# Altium schematic sheet Amplifier.SchDoc: Amplifier
size C; Engineer: Benjamin Beaudoin; Revision: v0.1
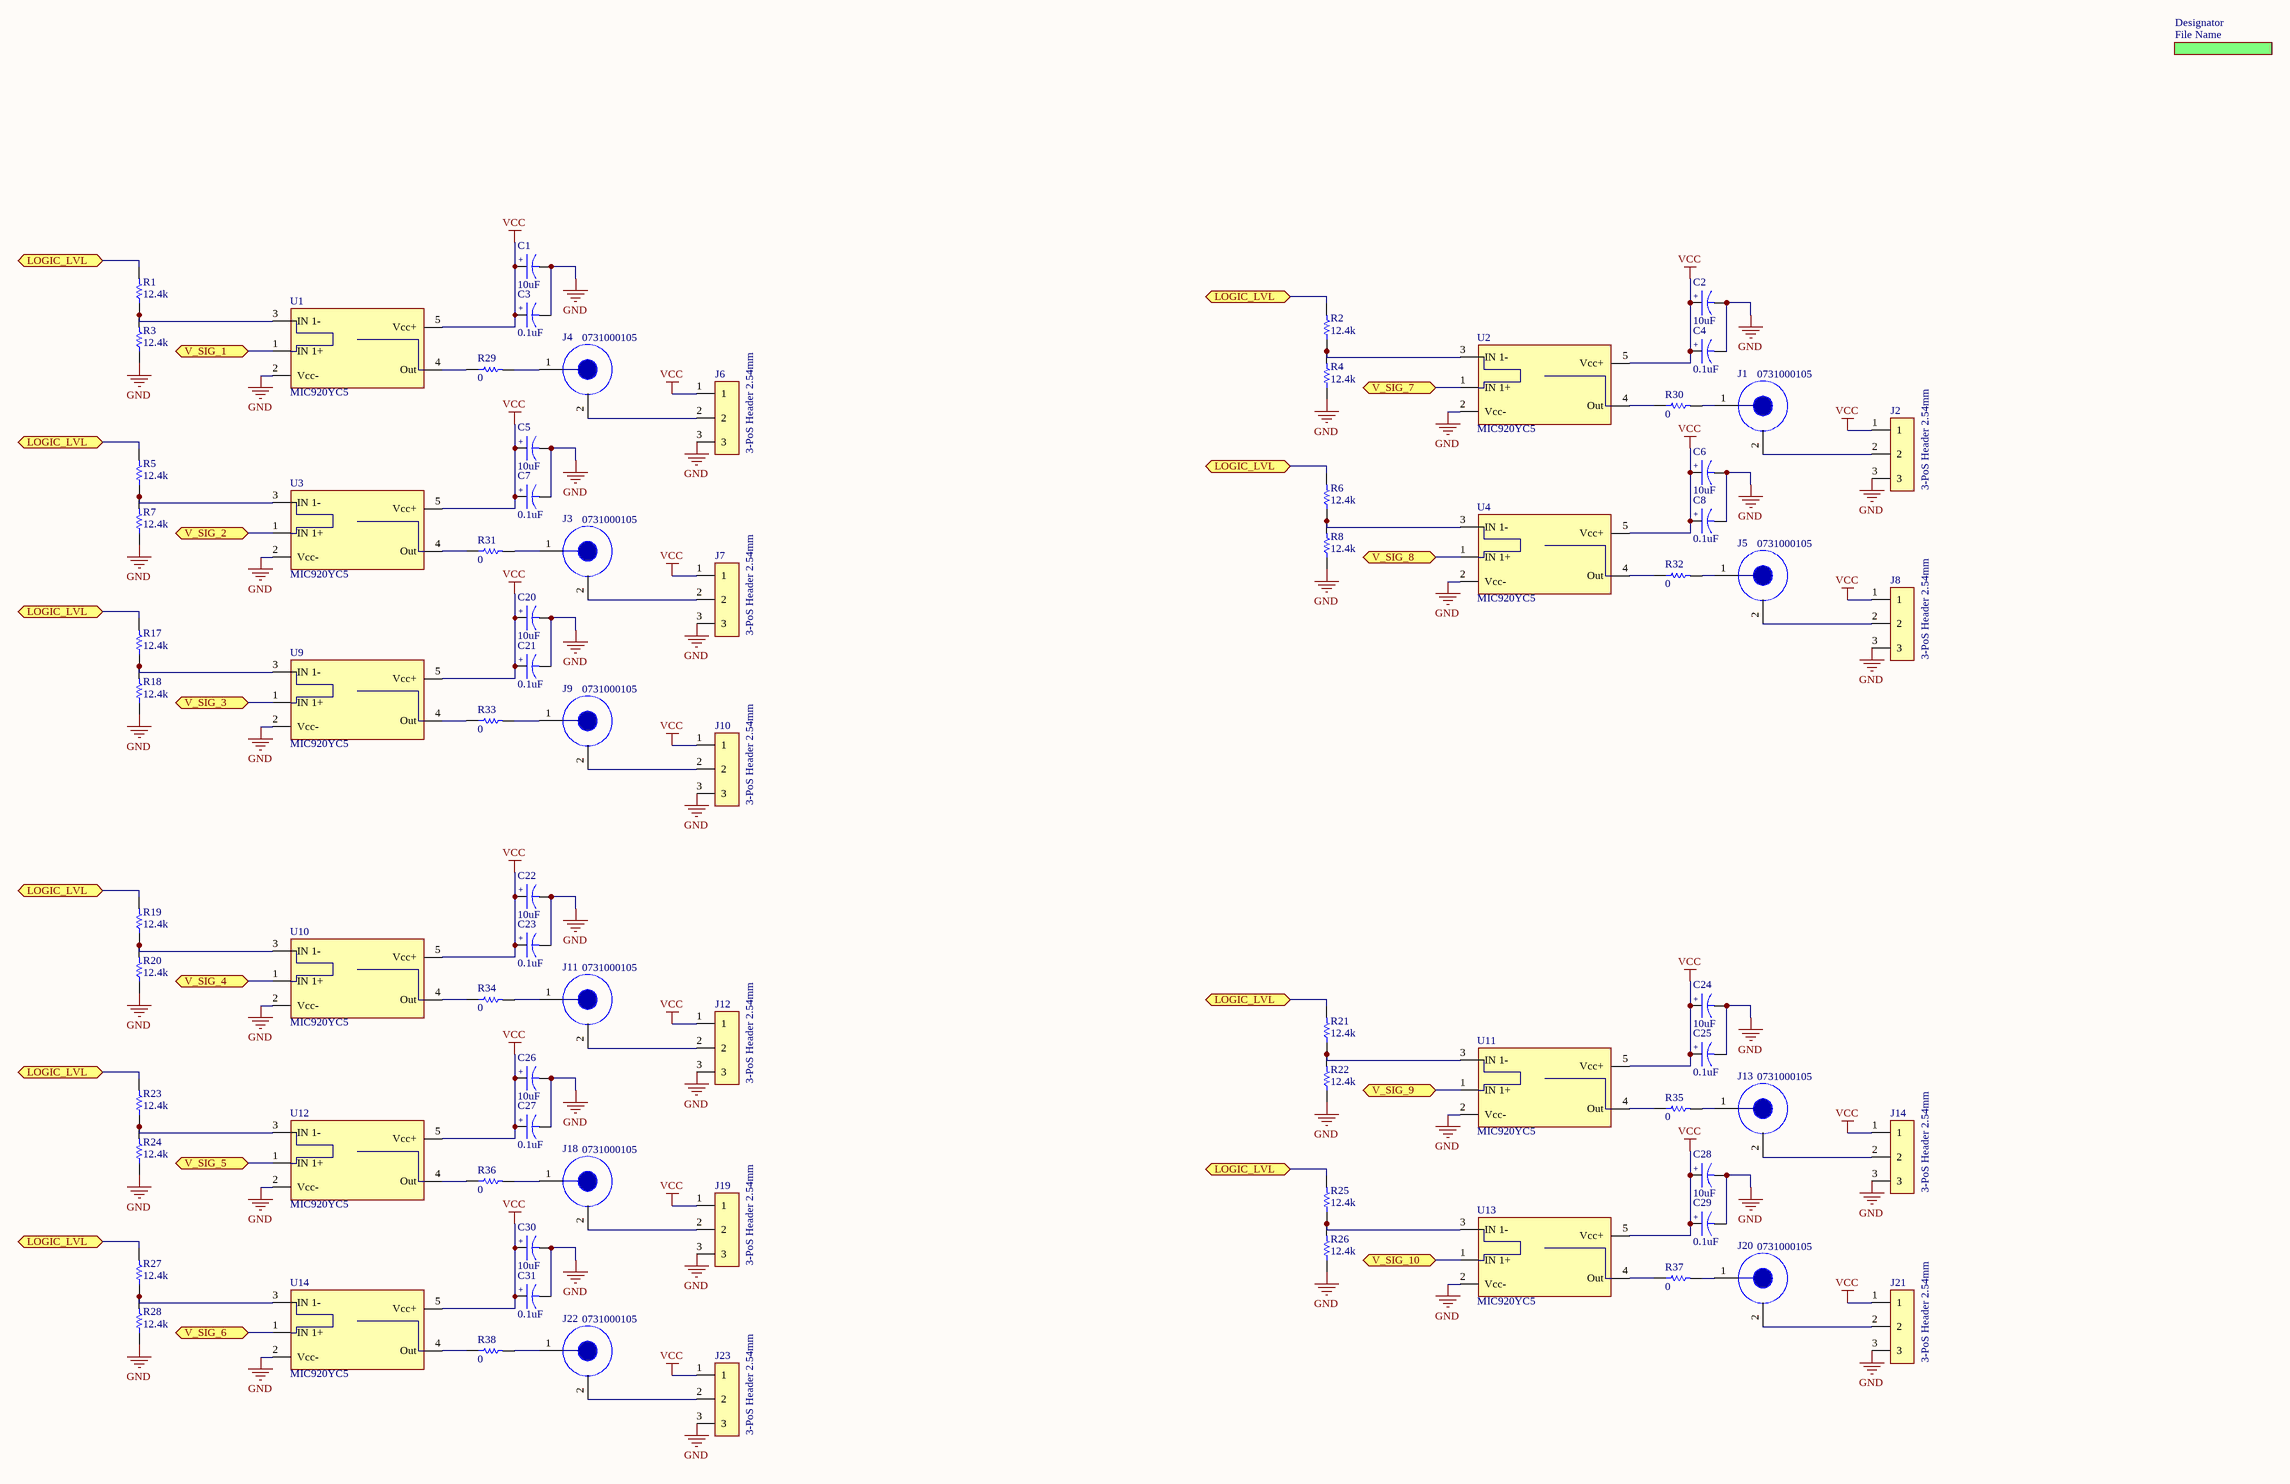
[diagram p0: Amplifier.SchDoc]

## Parts
C1  10uF  [0603C]
C2  10uF  [0603C]
C3  0.1uF  [0603C]
C4  0.1uF  [0603C]
C5  10uF  [0603C]
C6  10uF  [0603C]
C7  0.1uF  [0603C]
C8  0.1uF  [0603C]
C20  10uF  [0603C]
C21  0.1uF  [0603C]
C22  10uF  [0603C]
C23  0.1uF  [0603C]
C24  10uF  [0603C]
C25  0.1uF  [0603C]
C26  10uF  [0603C]
C27  0.1uF  [0603C]
C28  10uF  [0603C]
C29  0.1uF  [0603C]
C30  10uF  [0603C]
C31  0.1uF  [0603C]
J1  0731000105  [0731000105]
J2  3-PoS Header 2.54mm  [3-POS 2.54mm Pitch Header - duplicate]
J3  0731000105  [0731000105]
J4  0731000105  [0731000105]
J5  0731000105  [0731000105]
J6  3-PoS Header 2.54mm  [3-POS 2.54mm Pitch Header - duplicate]
J7  3-PoS Header 2.54mm  [3-POS 2.54mm Pitch Header - duplicate]
J8  3-PoS Header 2.54mm  [3-POS 2.54mm Pitch Header - duplicate]
J9  0731000105  [0731000105]
J10  3-PoS Header 2.54mm  [3-POS 2.54mm Pitch Header - duplicate]
J11  0731000105  [0731000105]
J12  3-PoS Header 2.54mm  [3-POS 2.54mm Pitch Header - duplicate]
J13  0731000105  [0731000105]
J14  3-PoS Header 2.54mm  [3-POS 2.54mm Pitch Header - duplicate]
J18  0731000105  [0731000105]
J19  3-PoS Header 2.54mm  [3-POS 2.54mm Pitch Header - duplicate]
J20  0731000105  [0731000105]
J21  3-PoS Header 2.54mm  [3-POS 2.54mm Pitch Header - duplicate]
J22  0731000105  [0731000105]
J23  3-PoS Header 2.54mm  [3-POS 2.54mm Pitch Header - duplicate]
R1  12.4k  [0603C]
R2  12.4k  [0603C]
R3  12.4k  [0603C]
R4  12.4k  [0603C]
R5  12.4k  [0603C]
R6  12.4k  [0603C]
R7  12.4k  [0603C]
R8  12.4k  [0603C]
R17  12.4k  [0603C]
R18  12.4k  [0603C]
R19  12.4k  [0603C]
R20  12.4k  [0603C]
R21  12.4k  [0603C]
R22  12.4k  [0603C]
R23  12.4k  [0603C]
R24  12.4k  [0603C]
R25  12.4k  [0603C]
R26  12.4k  [0603C]
R27  12.4k  [0603C]
R28  12.4k  [0603C]
R29  0  [1206C]
R30  0  [1206C]
R31  0  [1206C]
R32  0  [1206C]
R33  0  [1206C]
R34  0  [1206C]
R35  0  [1206C]
R36  0  [1206C]
R37  0  [1206C]
R38  0  [1206C]
U1  MIC920YC5  [MIC920]
U2  MIC920YC5  [MIC920]
U3  MIC920YC5  [MIC920]
U4  MIC920YC5  [MIC920]
U9  MIC920YC5  [MIC920]
U10  MIC920YC5  [MIC920]
U11  MIC920YC5  [MIC920]
U12  MIC920YC5  [MIC920]
U13  MIC920YC5  [MIC920]
U14  MIC920YC5  [MIC920]

## Sub-sheets
Designator = File Name: no entries

## Ports
LOGIC_LVL, V_SIG_1, V_SIG_2, V_SIG_3, V_SIG_4, V_SIG_5, V_SIG_6, V_SIG_7, V_SIG_8, V_SIG_9, V_SIG_10

## Nets
GND: C1.2 C2.2 C3.2 C4.2 C5.2 C6.2 C7.2 C8.2 C20.2 C21.2 C22.2 C23.2 C24.2 C25.2 C26.2 C27.2 C28.2 C29.2 C30.2 C31.2 J2.3 J6.3 J7.3 J8.3 J10.3 J12.3 J14.3 J19.3 J21.3 J23.3 R3.1 R4.1 R7.1 R8.1 R18.1 R20.1 R22.1 R24.1 R26.1 R28.1 U1.2(Vcc-) U2.2(Vcc-) U3.2(Vcc-) U4.2(Vcc-) U9.2(Vcc-) U10.2(Vcc-) U11.2(Vcc-) U12.2(Vcc-) U13.2(Vcc-) U14.2(Vcc-)
VCC: C1.1 C2.1 C3.1 C4.1 C5.1 C6.1 C7.1 C8.1 C20.1 C21.1 C22.1 C23.1 C24.1 C25.1 C26.1 C27.1 C28.1 C29.1 C30.1 C31.1 J2.1 J6.1 J7.1 J8.1 J10.1 J12.1 J14.1 J19.1 J21.1 J23.1 U1.5(Vcc+) U2.5(Vcc+) U3.5(Vcc+) U4.5(Vcc+) U9.5(Vcc+) U10.5(Vcc+) U11.5(Vcc+) U12.5(Vcc+) U13.5(Vcc+) U14.5(Vcc+)
LOGIC_LVL: R1.2 R2.2 R5.2 R6.2 R17.2 R19.2 R21.2 R23.2 R25.2 R27.2 ; port LOGIC_LVL
V_SIG_1: U1.1(IN_1+) ; port V_SIG_1
V_SIG_2: U3.1(IN_1+) ; port V_SIG_2
V_SIG_3: U9.1(IN_1+) ; port V_SIG_3
V_SIG_4: U10.1(IN_1+) ; port V_SIG_4
V_SIG_5: U12.1(IN_1+) ; port V_SIG_5
V_SIG_6: U14.1(IN_1+) ; port V_SIG_6
V_SIG_7: U2.1(IN_1+) ; port V_SIG_7
V_SIG_8: U4.1(IN_1+) ; port V_SIG_8
V_SIG_9: U11.1(IN_1+) ; port V_SIG_9
V_SIG_10: U13.1(IN_1+) ; port V_SIG_10
NetJ1_1: J1.1 R30.2
NetJ1_2: J1.2 J2.2
NetJ3_1: J3.1 R31.2
NetJ3_2: J3.2 J7.2
NetJ4_1: J4.1 R29.2
NetJ4_2: J4.2 J6.2
NetJ5_1: J5.1 R32.2
NetJ5_2: J5.2 J8.2
NetJ9_1: J9.1 R33.2
NetJ9_2: J9.2 J10.2
NetJ11_1: J11.1 R34.2
NetJ11_2: J11.2 J12.2
NetJ13_1: J13.1 R35.2
NetJ13_2: J13.2 J14.2
NetJ18_1: J18.1 R36.2
NetJ18_2: J18.2 J19.2
NetJ20_1: J20.1 R37.2
NetJ20_2: J20.2 J21.2
NetJ22_1: J22.1 R38.2
NetJ22_2: J22.2 J23.2
NetR1_1: R1.1 R3.2 U1.3(IN_1-)
NetR2_1: R2.1 R4.2 U2.3(IN_1-)
NetR5_1: R5.1 R7.2 U3.3(IN_1-)
NetR6_1: R6.1 R8.2 U4.3(IN_1-)
NetR17_1: R17.1 R18.2 U9.3(IN_1-)
NetR19_1: R19.1 R20.2 U10.3(IN_1-)
NetR21_1: R21.1 R22.2 U11.3(IN_1-)
NetR23_1: R23.1 R24.2 U12.3(IN_1-)
NetR25_1: R25.1 R26.2 U13.3(IN_1-)
NetR27_1: R27.1 R28.2 U14.3(IN_1-)
NetR29_1: R29.1 U1.4(Out)
NetR30_1: R30.1 U2.4(Out)
NetR31_1: R31.1 U3.4(Out)
NetR32_1: R32.1 U4.4(Out)
NetR33_1: R33.1 U9.4(Out)
NetR34_1: R34.1 U10.4(Out)
NetR35_1: R35.1 U11.4(Out)
NetR36_1: R36.1 U12.4(Out)
NetR37_1: R37.1 U13.4(Out)
NetR38_1: R38.1 U14.4(Out)

## Notes on the sheet
- (in symbol CPoly) +

## Library data of the parts
C1-C8 C20-C31 = CPoly: Cap Poly; Power_WV_SRF: 35V; MFG: *; MFGPN: *; Tolerance: *; Temp Coef: *; Distributor Reg Num: *; Distributor: *; CMPN: *
  C1 C2 C5 C6 C20 C22 C24 C26 C28 C30: Value: 10uF
  C3 C4 C7 C8 C21 C23 C25 C27 C29 C31: Value: 0.1uF
J1 J3-J5 J9 J11 J13 J18 J20 J22 = 0731000105: BNC Connector Jack, Female Socket 50Ohm Through Hole, Right Angle Solder
J2 J6-J8 J10 J12 J14 J19 J21 J23 = 3-PoS Header
R1-R8 R17-R38 = R: Resistor; Tolerance: 5%; Power_WV_SRF: *; MFG: *; MFGPN: *; Distributor: *; CMPN: *
  R1-R8 R17-R28: Value: 12.4k
  R29-R38: Value: 0
U1-U4 U9-U14 = MIC920YC5-TR: General Purpose Amplifier 1 Circuit SC-70-5